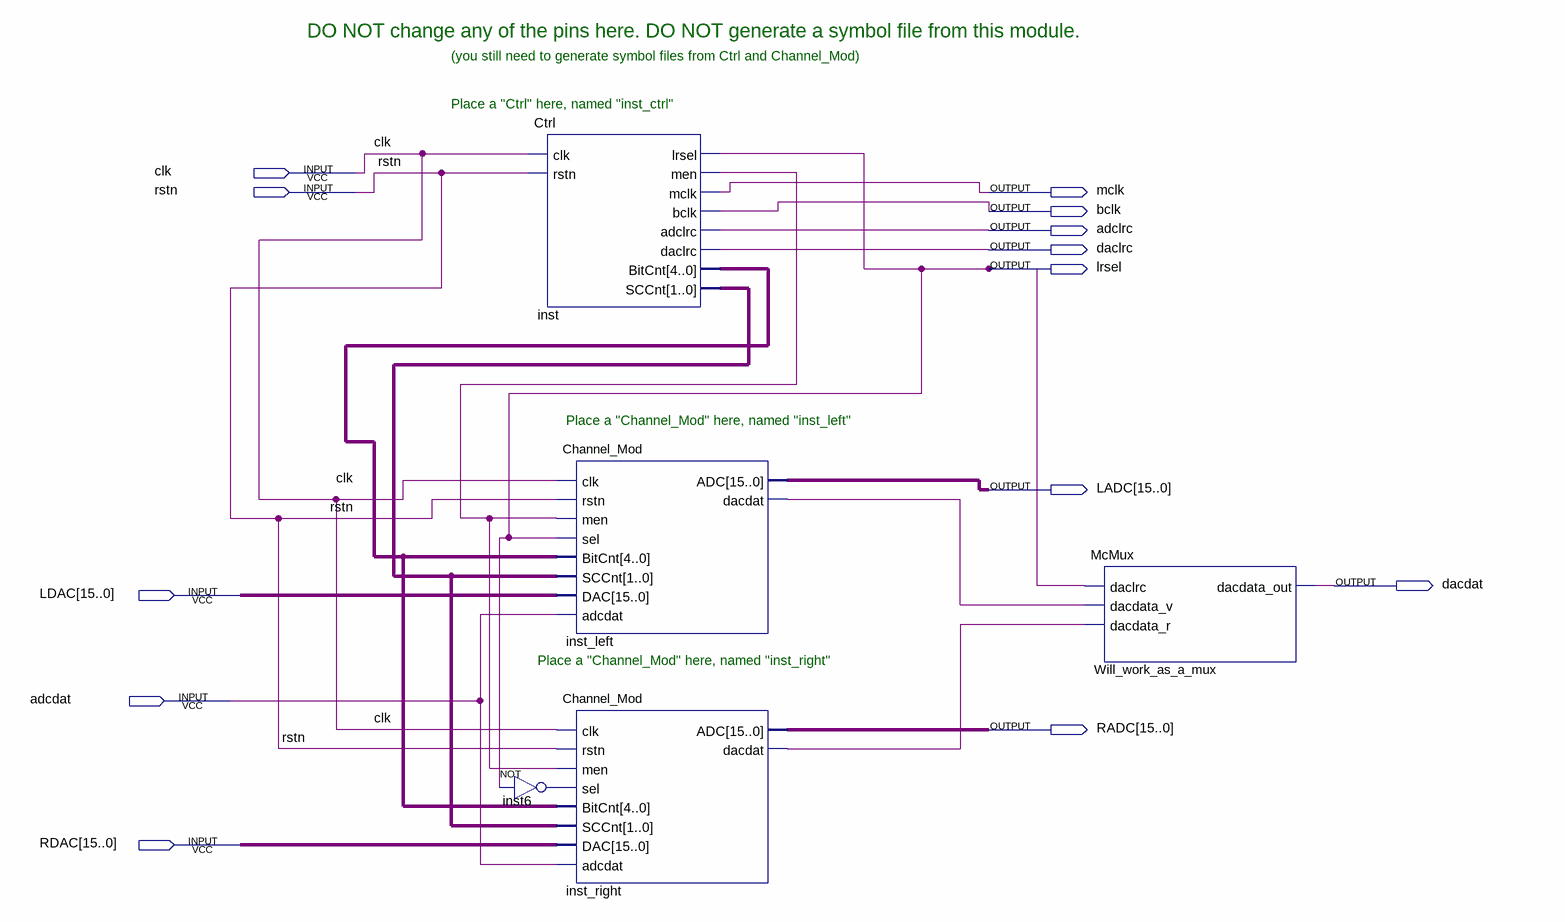
[diagram p0: schematic sheet]
// Quartus schematic SndDriver.bdf as structural Verilog: 5 symbols, 13 pins
module SndDriver (
  input  clk,
  input  rstn,
  input  [15:0] LDAC,
  input  adcdat,
  input  [15:0] RDAC,
  output mclk,
  output bclk,
  output adclrc,
  output daclrc,
  output lrsel,
  output [15:0] LADC,
  output dacdat,
  output [15:0] RADC
);

  wire inst6_out, inst_left_dacdat, inst_men, inst_right_dacdat;
  wire [1:0] inst_sccnt;
  wire [4:0] inst_bitcnt;

  not inst6 (inst6_out, lrsel);
  Ctrl inst (
    .clk(clk), .rstn(rstn), .lrsel(lrsel), .men(inst_men), .mclk(mclk), .bclk(bclk), .adclrc(adclrc),
    .daclrc(daclrc), .BitCnt(inst_bitcnt), .SCCnt(inst_sccnt));
  Channel_Mod inst_left (
    .clk(clk), .rstn(rstn), .men(inst_men), .sel(lrsel), .BitCnt(inst_bitcnt), .SCCnt(inst_sccnt),
    .DAC(LDAC), .adcdat(adcdat), .ADC(LADC), .dacdat(inst_left_dacdat));
  Channel_Mod inst_right (
    .clk(clk), .rstn(rstn), .men(inst_men), .sel(inst6_out), .BitCnt(inst_bitcnt), .SCCnt(inst_sccnt),
    .DAC(RDAC), .adcdat(adcdat), .ADC(RADC), .dacdat(inst_right_dacdat));
  McMux Will_work_as_a_mux (
    .daclrc(lrsel), .dacdata_v(inst_left_dacdat), .dacdata_r(inst_right_dacdat), .dacdata_out(dacdat));

  // Notes on the sheet:
  //   DO NOT change any of the pins here. DO NOT generate a symbol file from this module.
  //   (you still need to generate symbol files from Ctrl and Channel_Mod)
  //   Place a "Ctrl" here, named "inst_ctrl"
  //   Place a "Channel_Mod" here, named "inst_left"
  //   Place a "Channel_Mod" here, named "inst_right"
endmodule
